# Altium schematic sheet MAZ000171 - Diagrama físico.SchDoc: MAZ000171 - Diagrama físico
size A; ApprovedBy: Christian Ledwidth; CheckedBy: Nahuel Martinez; Author: Santiago Marti; CompanyName: Body Health; DrawnBy: Santiago Marti; Revision: A; SheetNumber: 2; SheetTotal: 2
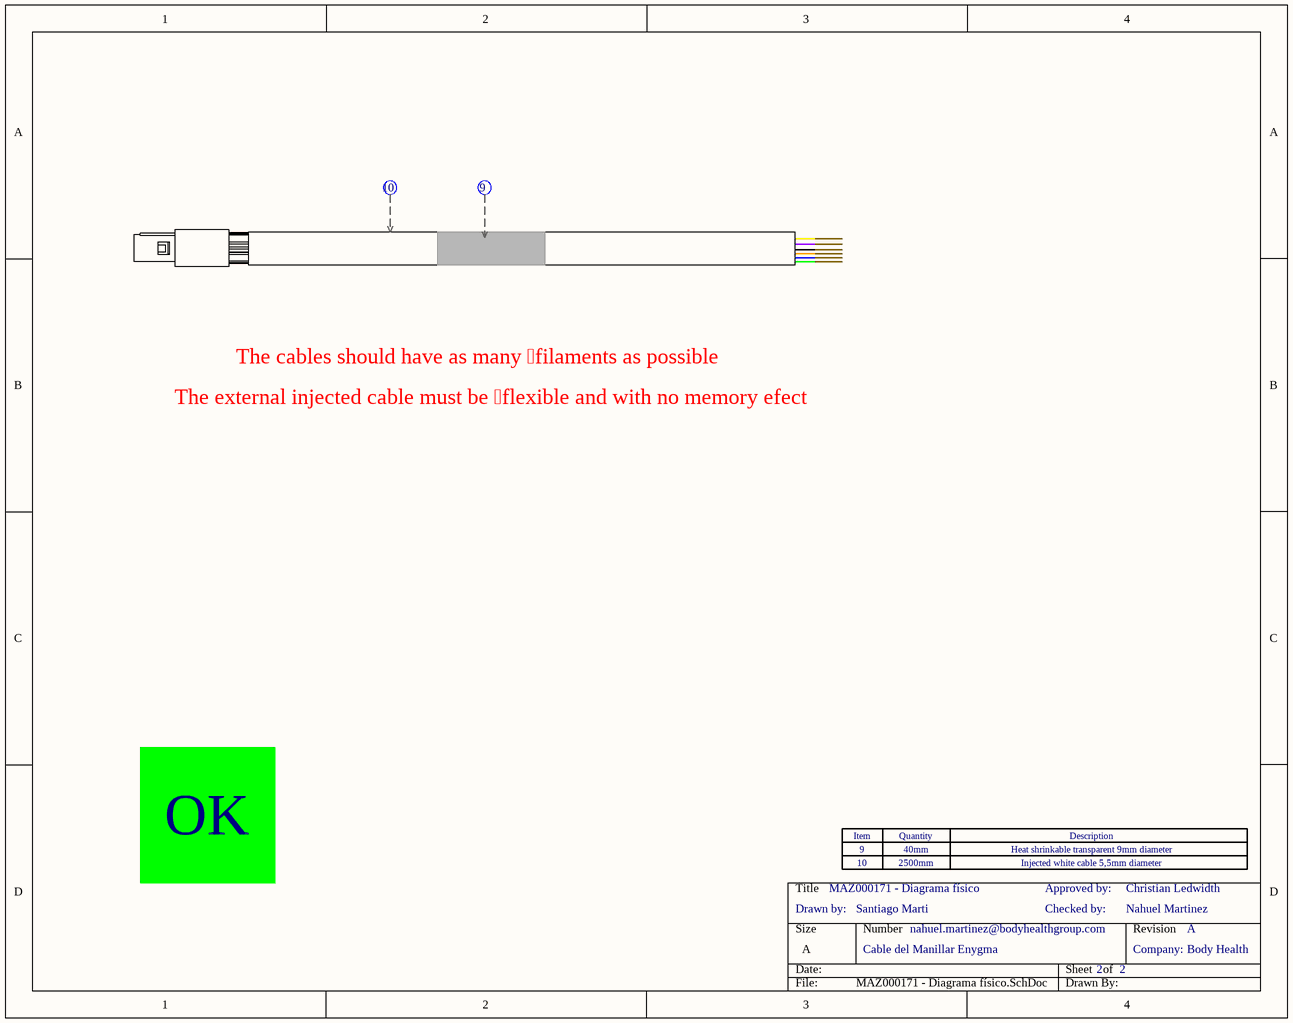
[diagram p0: MAZ000171 - Diagrama físico.SchDoc]

## Parts
Cab1  Cable  (value not drawn)
Cab?  Cable  (value not drawn)
Conn1  SZCNT_07_Macho  (value not drawn)  (part A of 3)
Zoc1  Zócalo_Header  (value not drawn)
Zoc11  Zócalo_Item  (value not drawn)
Zoc?  Zócalo_Item  (value not drawn)

## Notes on the sheet
- The cables should have as many filaments as possible
- The external injected cable must be flexible and with no memory efect
- OK
- Drawn by:
- 9
- 10
- 40mm
- 2500mm
- Checked by:
- Approved by:
- Heat shrinkable transparent 9mm diameter
- Injected white cable 5,5mm diameter
- Cable del Manillar Enygma
- nahuel.martinez@bodyhealthgroup.com
- Company:
- (in symbol Zócalo_Header) Item; Quantity; Description

## Library data of the parts
Cab1 = Cable: CallOut: 10; Largo: *mm; Sección: *mm2; Color: *
Cab? = Cable: CallOut: 9; Largo: *mm; Sección: *mm2; Color: *
Conn1 = SZCNT_07_Macho: Conector SZCNT 7 vías macho para cable; Cod.DigiKey: Se compra a SZCNT; Cod.Fabricante: *; ComponentLink1Description: Manufacturer Link; ComponentLink1URL: *; DIGIKEYx100: *; Fabricante: SZCNT; CallOut: *; DIGIKEYx50: *
Zoc1 = Zócalo_Header: Header para el zócalo de referencias
Zoc11 Zoc? = Zócalo_Item: Ítem para el zócalo de referencias; Desginator: *; Quantity: *; ItemDescription: *